# EAGLE design layout (EAGLE 9.6.2)
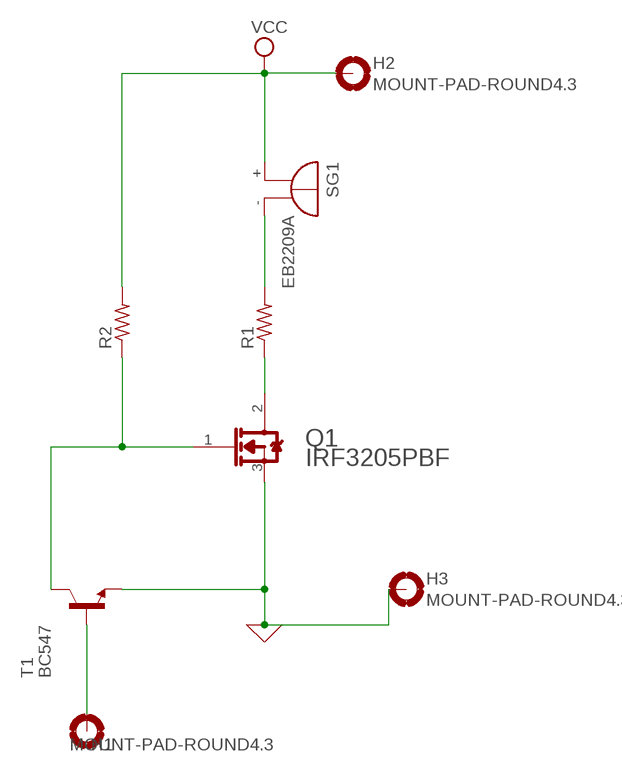
[diagram p0: schematic, sheet 1]

## Parts
H1  MOUNT-PAD-ROUND4.3  [4,3-PAD]
H2  MOUNT-PAD-ROUND4.3  [4,3-PAD]
H3  MOUNT-PAD-ROUND4.3  [4,3-PAD]
Q1  INFINEON_IRF3205PBFINFINEON_IRF3205PBF_0_0  [INFINEON_IRF3205PBF_0]
R1  R-US_RDH/15  [RDH/15]
R2  R-US_RDH/15  [RDH/15]
SG1  EB2209A  [EB2209A]
T1  BC547  [TO92]

## Nets
0: H3.B4,3(MOUNT) Q1.3(SOURCE) T1.1(E) ; supply symbol labelled GND
N$1: R1.2 SG1.-
N$2: Q1.2(DRAIN) R1.1
N$3: Q1.1(GATE) R2.1 T1.3(C)
N$4: H1.B4,3(MOUNT) T1.2(B)
VCC: H2.B4,3(MOUNT) R2.2 SG1.+

## Library data of the parts
H1-H3 = holes:MOUNT-PAD-ROUND: MOUNTING PAD, round
Q1 = Infineon - IRF3205PBF:INFINEON_IRF3205PBF: MOSFET Transistor, N Channel, 110 A, 55 V, 8 mohm, 10 V, 4 V; CENTROID_NOT_SPECIFIED: No; CONTINUOUS_DRAIN_CURRENT: 110A; DATASHEET: https://www.infineon.com/dgdl/irf3205pbf.pdf?fileId=5546d462533600a4015355def244190a; DEVICE_CLASS_L1: Discrete Semiconductors; DEVICE_CLASS_L2: Transistors; DEVICE_CLASS_L3: MOSFETs; DIGIKEY_DESCRIPTION: TRANS MOSFET N-CH 55V 110A TO-220AB; DIGIKEY_PART_NUMBER: IRF3205PBF-ND; DRAIN_TO_SOURCE_BREAKDOWN_VOLTAGE: 55V; DRAIN_TO_SOURCE_RESISTANCE: 8mΩ; DRAIN_TO_SOURCE_VOLTAGE: 55V; FOOTPRINT_URL: https://www.infineon.com/dgdl/po-to220ab-fp.pdf?fileId=5546d462580663ef0158068cfbee01be; GATE_TO_SOURCE_VOLTAGE: 20V; HEIGHT: 19.8mm; INPUT_CAPACITACE_AT_VDS: 3247pF @ 25V; LEAD_FREE: yes; MAX_JUNCTION_TEMP: +175°C; MF: Infineon; MFG_PACKAGE_IDENT: PG-TO220-3; MFG_PACKAGE_IDENT_DATE: 0; MFG_PACKAGE_IDENT_REV: 904; MOUSER_DESCRIPTION: MOSFET MOSFT 55V 98A 8mOhm 97.3nC; MOUSER_PART_NUMBER: 942-IRF3205PBF; MPN: IRF3205PBF; NUMBER_OF_CHANNELS: 1; NUMBER_OF_N_CHANNELS: 1; PACKAGE: TO-220AB; POWER_DISSIPATION: 200W; PREFIX: Q; ROHS: yes; STANDOFF_HEIGHT: 3.37mm; TECHNOLOGY: MOSFET; TEMPERATURE_RANGE_HIGH: +175°C; TEMPERATURE_RANGE_LOW: -55°C; THRESHOLD_VGS: 2-4V; TURN_OFF_DELAY_TIME: 50ns; TURN_ON_DELAY_TIME: 14ns; VERIFICATION_VERSION: 0.0.0.1
R1 R2 = rcl:R-US_: RESISTOR, American symbol; SPICEPREFIX: R
SG1 = buzzer:EB2209A: BUZZER Source: Buerklin; OC_FARNELL: unknown; OC_NEWARK: unknown
T1 = transistor-neu-to92:BC547: NPN TRANSISTOR

## Board
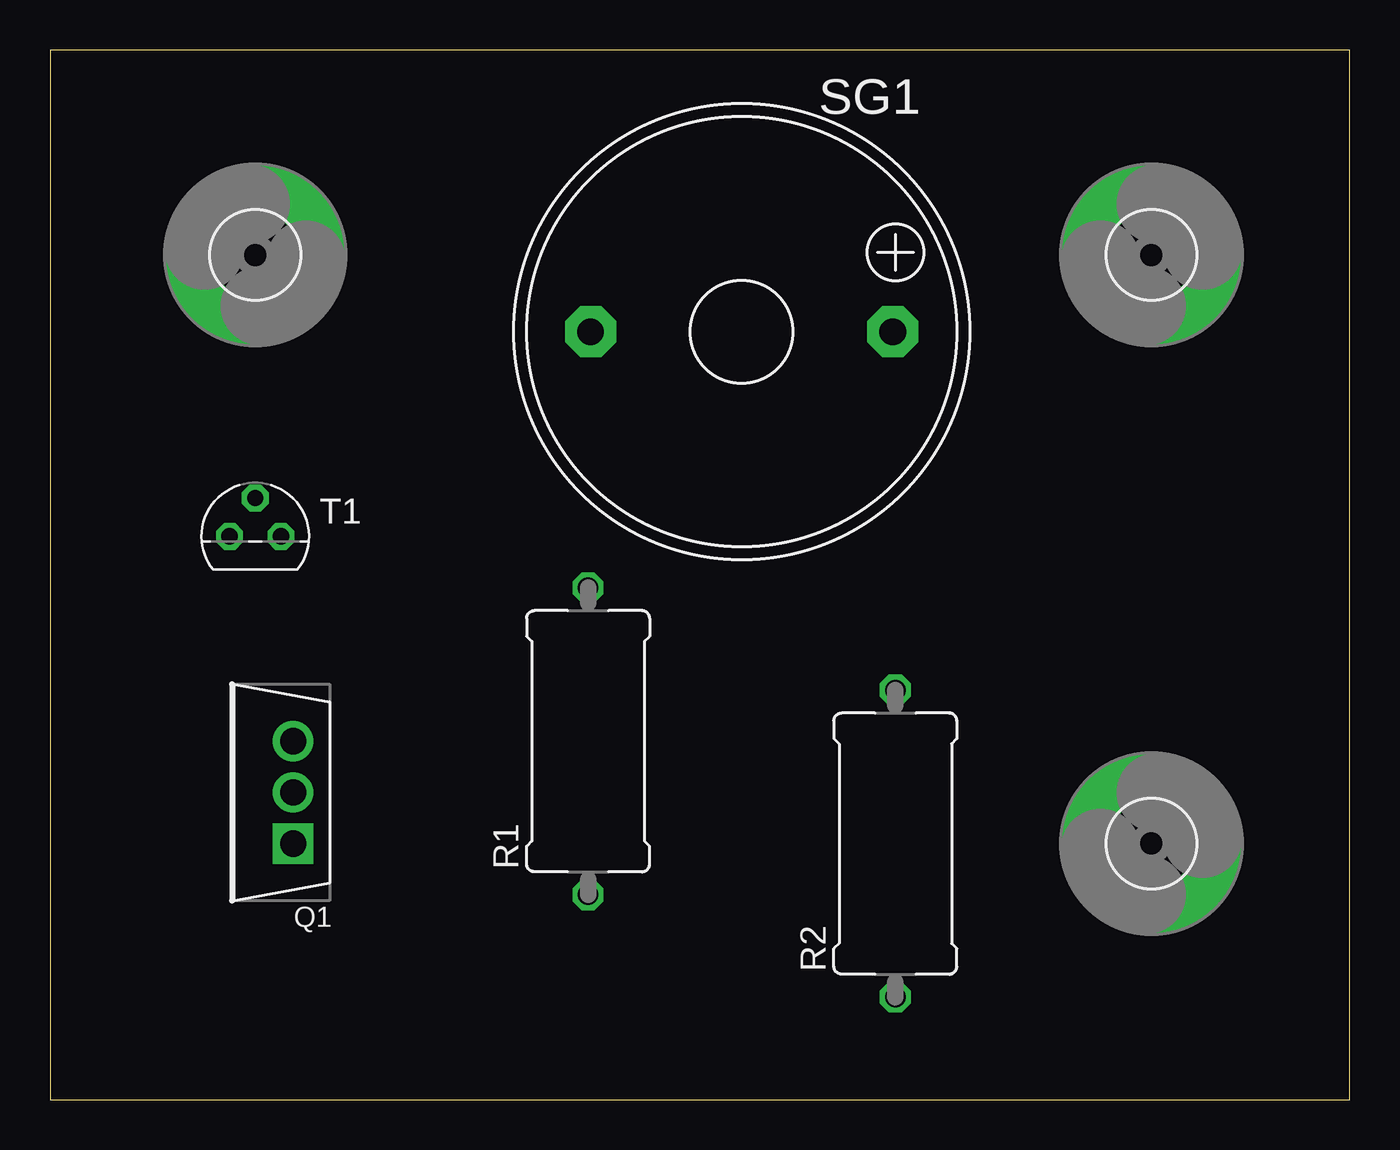
[diagram p1: board, top side]
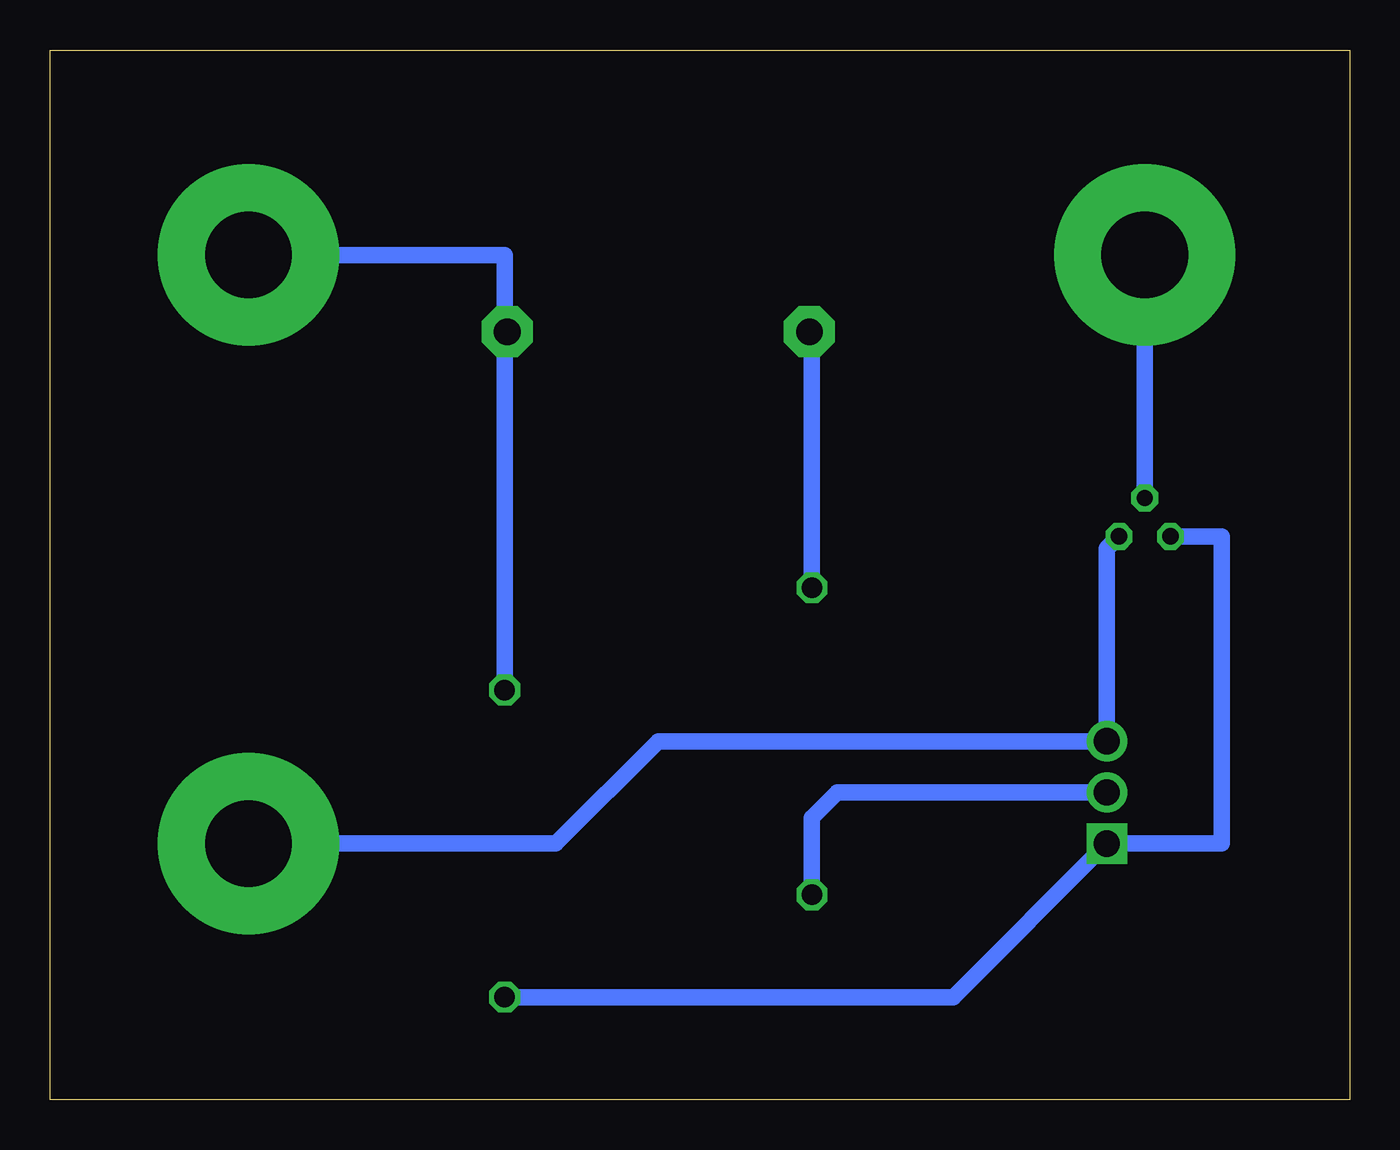
[diagram p2: board, bottom side, seen from below]

Size 64.44 x 52.06 mm. Coordinates in mm from the lower left corner, seen from the top.
Outline: 0,0 64.44,0 64.44,52.06 0,52.06 0,0
Copper layers (1*16): Top 0.035mm / dielectric 1.5mm / Bottom 0.035mm
Design rules "default": minimum track width 6mil, minimum drill 0.35mm, track to track 6mil, track to pad 6mil, pad to pad 6mil, via to via 6mil, smd to smd 6mil, copper to edge 40mil, drill to drill 6mil, minimum pad ring 10mil, minimum via ring 8mil, stop-mask expansion 4mil, vias tented up to drill 0mil, thermal gap 10mil

### Footprints (pad centres in the part's own frame; a part is rotated, then mirrored left to right if it is on the bottom)
4,3-PAD = drill 4.3 pad 9: B4,3 0,0
INFINEON_IRF3205PBF_0 = drill 1.3 pad 2 square: 1 -0.61,2.54 | drill 1.3 pad 2: 2 -0.61,0; 3 -0.61,-2.54
RDH/15 = drill 1.016 octagon: 1 -7.62,0; 2 7.62,0
EB2209A = drill 1.321 pad 2.54 octagon: + 7.493,0; - -7.493,0
TO92 = drill 0.813 octagon: 1 1.27,0; 2 0,1.905; 3 -1.27,0

### Placement (x,y rotation side)
H1  10.16,41.91 90 top
H2  54.61,41.91 0 top
H3  54.61,12.7 0 top
Q1  11.43,15.24 180 top
R1  26.67,17.78 90 top
R2  41.91,12.7 90 top
SG1  34.29,38.1 0 top
T1  10.16,27.94 0 top

### Tracks (layer width: path | path; a pad name or v marks a point on that pad's centre or on a via)
0
  Bottom 0.813: T1.1 12.04,27.33 Q1.3 34.29,17.78 39.37,12.7 H3.B4,3
N$1
  Bottom 0.813: R1.2 26.67,37.97 SG1.-
N$2
  Bottom 0.813: Q1.2 25.4,15.24 26.67,13.97 R1.1
N$3
  Bottom 0.813: T1.3 6.35,27.94 6.35,12.7 Q1.1 19.66,5.08 R2.1
N$4
  Bottom 0.813: H1.B4,3 T1.2
VCC
  Bottom 0.813: SG1.+ 41.91,37.97 | 41.91,37.97 R2.2 | H2.B4,3 41.91,41.91 41.91,37.97